# EAGLE design motion_daughter (EAGLE 7.7.0)
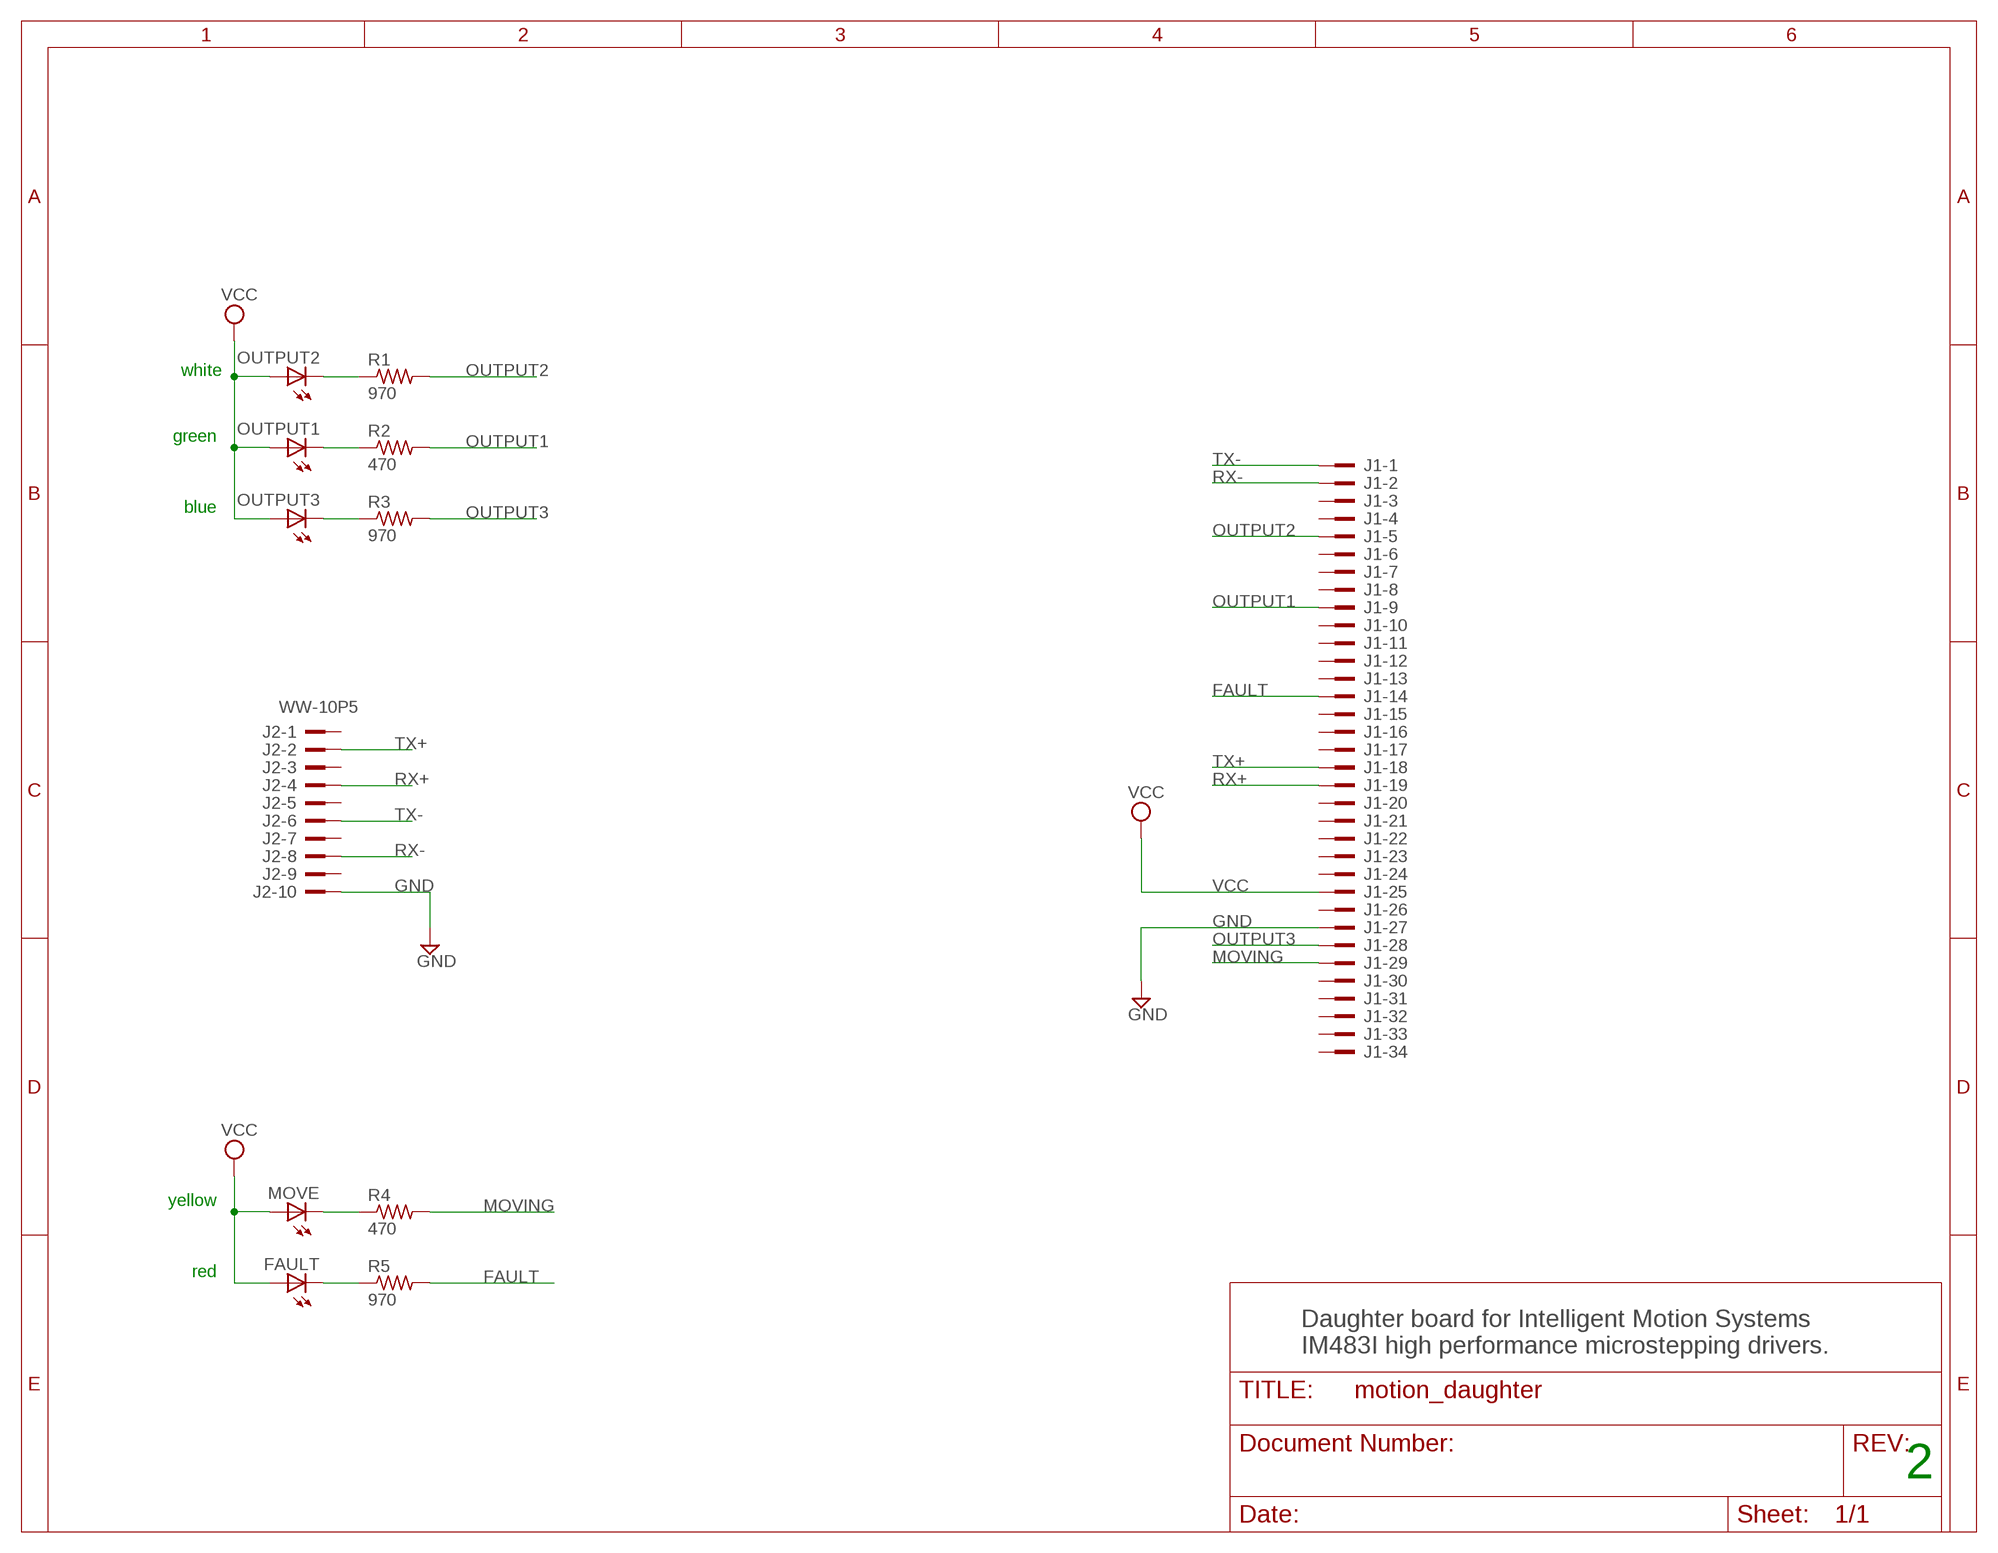
[diagram p0: schematic, sheet 1]

## Parts
FAULT  LED3MM  [LED3MM]
J1  WW-34P-SPECIALIM483I_HEADER  [PAK100/2500-34]
J2  WW-10P5  [PAK100/2500-5-10]
MOVE  LED3MM  [LED3MM]
OUTPUT1  LED3MM  [LED3MM]
OUTPUT2  LED3MM  [LED3MM]
OUTPUT3  LED3MM  [LED3MM]
R1  970  R-US_0207/7  [0207/7]
R2  470  R-US_0207/7  [0207/7]
R3  970  R-US_0207/7  [0207/7]
R4  470  R-US_0207/7  [0207/7]
R5  970  R-US_0207/7  [0207/7]

## Nets
FAULT: J1.P14 R5.2
GND: J1.P27 J2.10
MOVING: J1.P29 R4.2
N$1: OUTPUT3.K(C) R3.1
N$2: OUTPUT1.K(C) R2.1
N$3: OUTPUT2.K(C) R1.1
N$4: MOVE.K(C) R4.1
N$5: FAULT.K(C) R5.1
OUTPUT1: J1.P9 R2.2
OUTPUT2: J1.P5 R1.2
OUTPUT3: J1.P28 R3.2
RX+: J1.P19 J2.4
RX-: J1.P2 J2.8
TX+: J1.P18 J2.2
TX-: J1.P1 J2.6
VCC: FAULT.A J1.P25 MOVE.A OUTPUT1.A OUTPUT2.A OUTPUT3.A
Unconnected: J1.P3 J1.P4 J1.P6 J1.P7 J1.P8 J1.P10 J1.P11 J1.P12 J1.P13 J1.P15 J1.P16 J1.P17 J1.P20 J1.P21 J1.P22 J1.P23 J1.P24 J1.P26 J1.P30 J1.P31 J1.P32 J1.P33 J1.P34 J2.1 J2.3 J2.5 J2.7 J2.9

## Notes on the sheet
- white
- green
- blue
- yellow
- red
- Daughter board for Intelligent Motion Systems 
  IM483I high performance microstepping drivers.
- 2

## Library data of the parts
FAULT MOVE OUTPUT1-OUTPUT3 = led:LED: LED OSRAM: - CHIPLED LG R971, LG N971, LY N971, LG Q971, LY Q971, LO R971, LY R971 LH N974, LH R974 LS Q976, LO Q976, LY Q976 LO Q996 - Hyper CHIPLED LW Q18S LB Q993, LB Q99A, LB R99A - SideLED LS A670, LO A670, LY A670, LG A670, LP A670 LB A673, LV A673, LT A673, LW A673 LH A674 LY A675 LS A676, LA A676, LO A676, LY A676, LW A676 LS A679, LY A679, LG A679 - Hyper Micro SIDELED® LS Y876, LA Y876, LO Y876, LY Y876 LT Y87S - SmartLED LW L88C, LW L88S LB L89C, LB L89S, LG L890 LS L89K, LO L89K, LY L89K LS L896, LA L896, LO L896, LY L896 - TOPLED LS T670, LO T670, LY T670, LG T670, LP T670 LSG T670, LSP T670, LSY T670, LOP T670, LYG T670 LG T671, LOG T671, LSG T671 LB T673, LV T673, LT T673, LW T673 LH T674 LS T676, LA T676, LO T676, LY T676, LB T676, LH T676, LSB T676, LW T676 LB T67C, LV T67C, LT T67C, LS T67K, LO T67K, LY T67K, LW E67C LS E67B, LA E67B, LO E67B, LY E67B, LB E67C, LV E67C, LT E67C LW T67C LS T679, LY T679, LG T679 LS T770, LO T770, LY T770, LG T770, LP T770 LB T773, LV T773, LT T773, LW T773 LH T774 LS E675, LA E675, LY E675, LS T675 LS T776, LA T776, LO T776, LY T776, LB T776 LHGB T686 LT T68C, LB T68C - Hyper Mini TOPLED® LB M676 - Mini TOPLED Santana® LG M470 LS M47K, LO M47K, LY M47K Source: http://www.osram.convergy.de LUXEON: - LUMILED® LXK2-PW12-R00, LXK2-PW12-S00, LXK2-PW14-U00, LXK2-PW14-V00 LXK2-PM12-R00, LXK2-PM12-S00, LXK2-PM14-U00 LXK2-PE12-Q00, LXK2-PE12-R00, LXK2-PE12-S00, LXK2-PE14-T00, LXK2-PE14-U00 LXK2-PB12-K00, LXK2-PB12-L00, LXK2-PB12-M00, LXK2-PB14-N00, LXK2-PB14-P00, LXK2-PB14-Q00 LXK2-PR12-L00, LXK2-PR12-M00, LXK2-PR14-Q00, LXK2-PR14-R00 LXK2-PD12-Q00, LXK2-PD12-R00, LXK2-PD12-S00 LXK2-PH12-R00, LXK2-PH12-S00 LXK2-PL12-P00, LXK2-PL12-Q00, LXK2-PL12-R00 Source: www.luxeon.com KINGBRIGHT: KA-3528ASYC Source: www.kingbright.com
J1 = worlickwerx:WW-34P-SPECIAL: 34 pin header, special pin numbers; OC_FARNELL: unknown; OC_NEWARK: unknown
J2 = worlickwerx:WW-10P: 3M (TM) Pak 100 4-Wall Header Source: 3M; OC_FARNELL: 1788669; OC_NEWARK: unknown
R1-R5 = resistor:R-US_: RESISTOR, American symbol

## Board
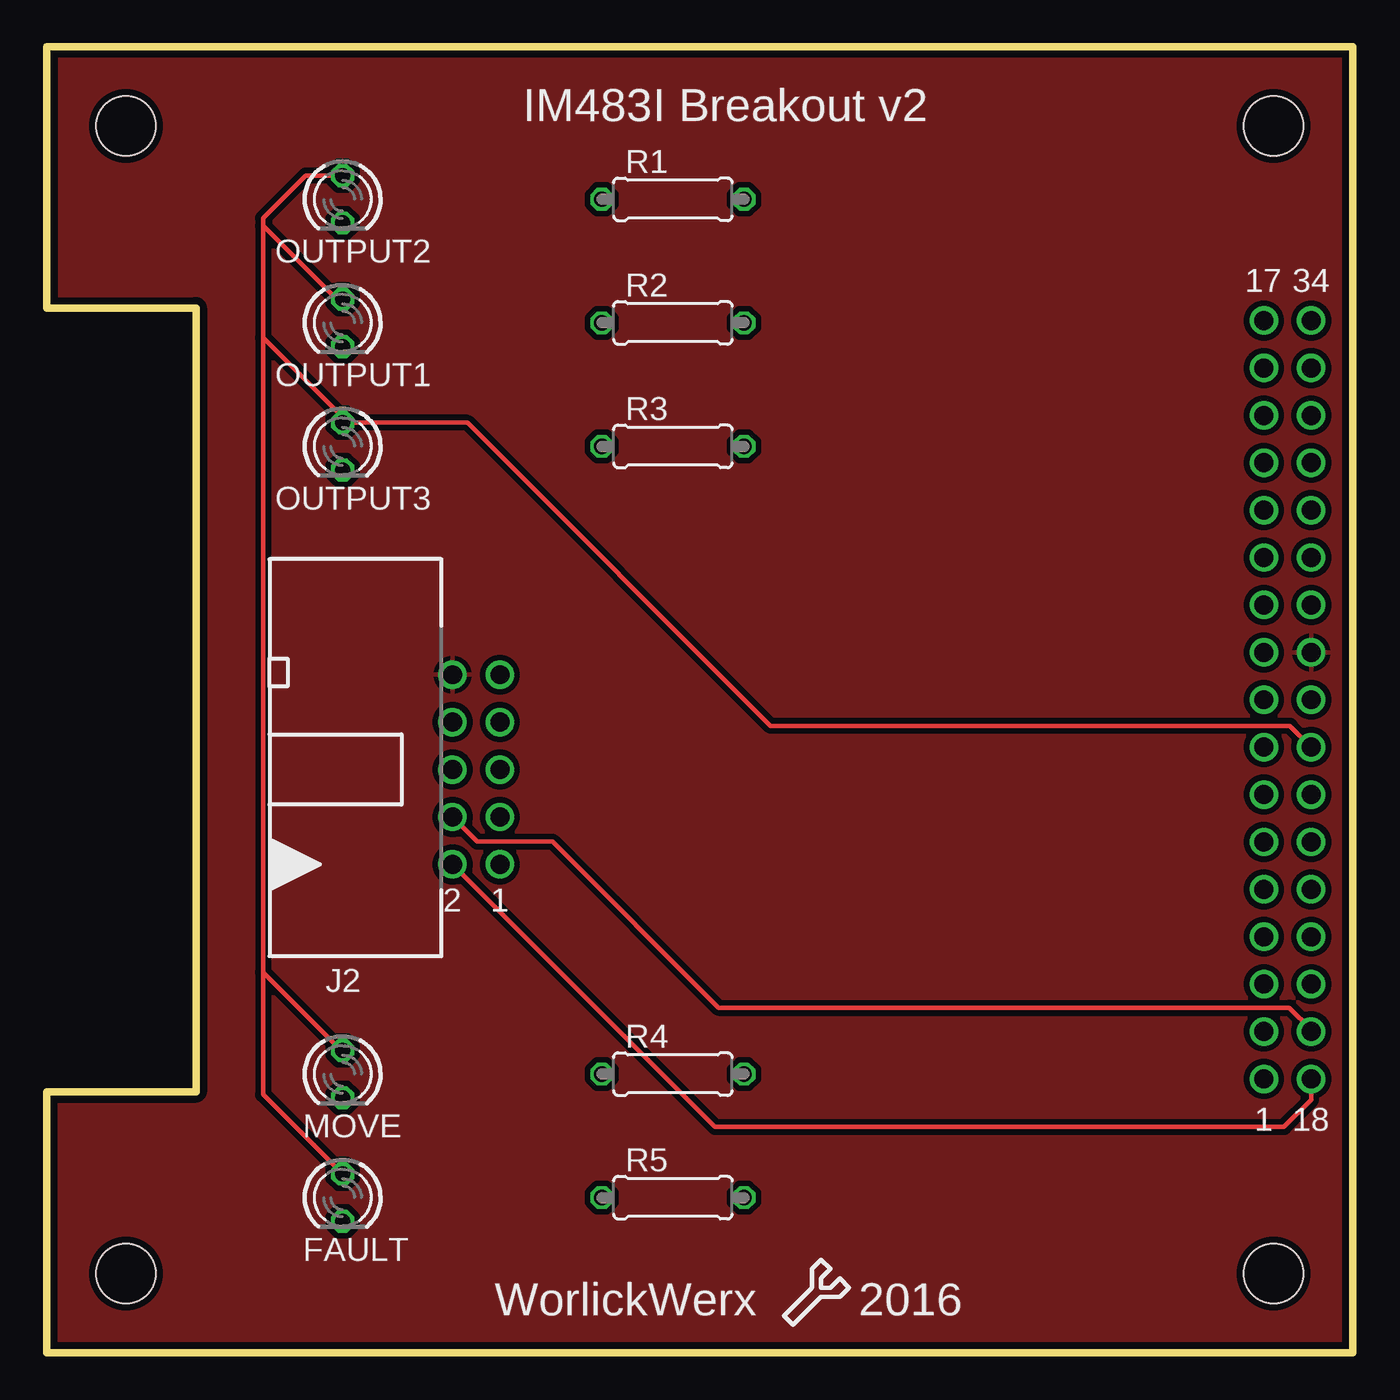
[diagram p1: board, top side]
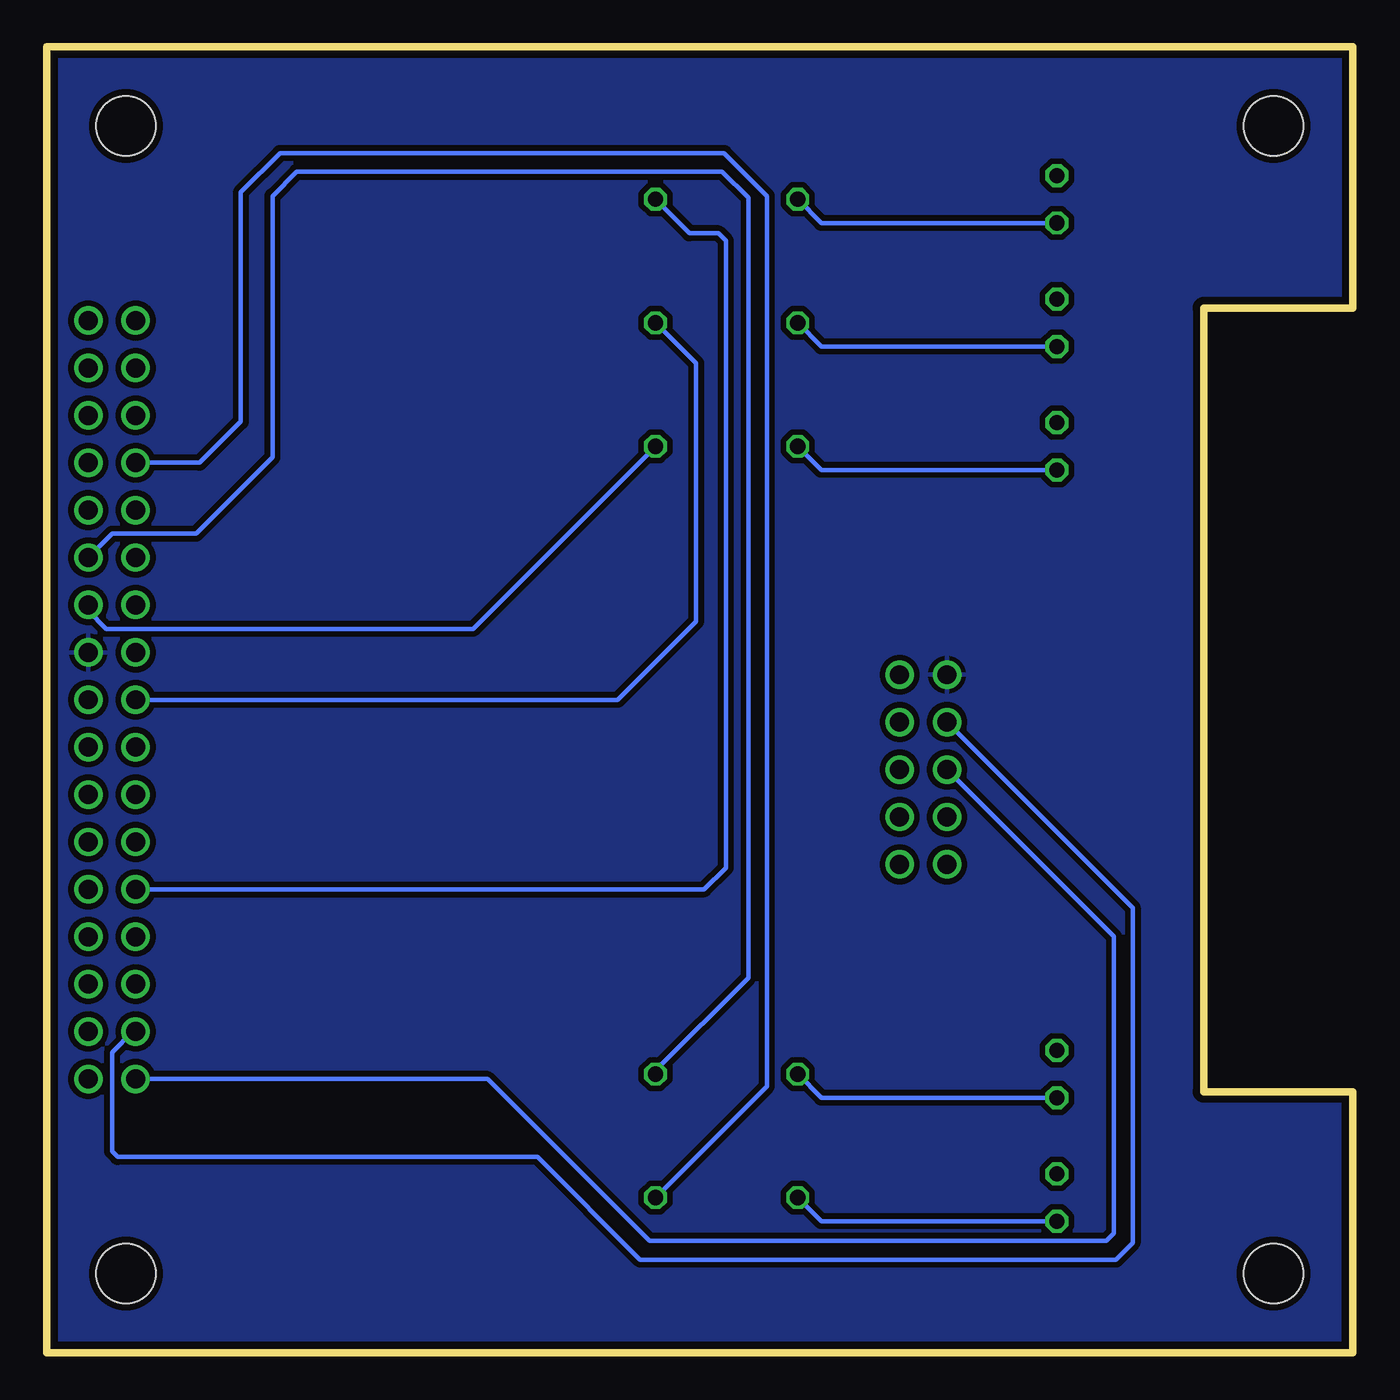
[diagram p2: board, bottom side, seen from below]

Size 70 x 70 mm. Coordinates in mm from the lower left corner, seen from the top.
Outline: 0,0 70,0 70,70 0,70 0,56 8,56 8,14 0,14 0,0
Copper layers (1*16): Top 0.0356mm / dielectric 1.5011mm / Bottom 0.0356mm
Design rules "oshpark-2layer": minimum track width 6mil, minimum drill 13mil, track to track 6mil, track to pad 6mil, pad to pad 6mil, via to via 6mil, smd to smd 6mil, copper to edge 15mil, drill to drill 6mil, minimum pad ring 7mil, minimum via ring 7mil, stop-mask expansion 2.5mil, vias tented up to drill 0mil, thermal gap 10mil
Holes 3.17 mm at 4.25,65.75 4.25,4.25 65.75,4.25 65.75,65.75
Milling: 8 lines

### Footprints (pad centres in the part's own frame; a part is rotated, then mirrored left to right if it is on the bottom)
LED3MM = drill 0.813 octagon: A -1.27,0; K 1.27,0
PAK100/2500-34 = drill 1.016 pad 1.422: P1 -20.32,1.27; P2 -17.78,1.27; P3 -15.24,1.27; P4 -12.7,1.27; P5 -10.16,1.27; P6 -7.62,1.27; P7 -5.08,1.27; P8 -2.54,1.27; P9 0,1.27; P10 2.54,1.27; P11 5.08,1.27; P12 7.62,1.27; P13 10.16,1.27; P14 12.7,1.27; P15 15.24,1.27; P16 17.78,1.27; P17 20.32,1.27; P18 -20.32,-1.27; P19 -17.78,-1.27; P20 -15.24,-1.27; P21 -12.7,-1.27; P22 -10.16,-1.27; P23 -7.62,-1.27; P24 -5.08,-1.27; P25 -2.54,-1.27; P26 0,-1.27; P27 2.54,-1.27; P28 5.08,-1.27; P29 7.62,-1.27; P30 10.16,-1.27; P31 12.7,-1.27; P32 15.24,-1.27; P33 17.78,-1.27; P34 20.32,-1.27
PAK100/2500-5-10 = drill 1.016 pad 1.422: 1 -5.08,-1.27; 2 -5.08,1.27; 3 -2.54,-1.27; 4 -2.54,1.27; 5 0,-1.27; 6 0,1.27; 7 2.54,-1.27; 8 2.54,1.27; 9 5.08,-1.27; 10 5.08,1.27
0207/7 = drill 0.813 octagon: 1 -3.81,0; 2 3.81,0

### Placement (x,y rotation side)
FAULT  15.86,8.32 270 top
J1  66.5,35 90 top
J2  23.02,31.26 90 top
MOVE  15.86,14.94 270 top
OUTPUT1  15.86,55.2 270 top
OUTPUT2  15.86,61.82 270 top
OUTPUT3  15.86,48.58 270 top
R1  33.56,61.82 0 top
R2  33.56,55.2 0 top
R3  33.56,48.58 0 top
R4  33.56,14.94 0 top
R5  33.56,8.32 0 top

### Tracks (layer width: path | path; a pad name or v marks a point on that pad's centre or on a via)
FAULT
  Bottom 0.254: R5.2 31.4,14.29 31.4,62 33.7,64.3 57.5,64.3 59.6,62.2 59.6,49.9 61.8,47.7 J1.P14
GND
  pour Bottom (isolate 0.305): 0,70 0,56 8,56 8,14 0,14 0,0 70,0 70,70
  pour Top (isolate 0.305): 0,70 0,56 8,56 8,14 0,14 0,0 70,0 70,70
MOVING
  Bottom 0.254: J1.P29 66.49,43.9 62,43.9 57.9,48 57.9,62 56.6,63.3 33.8,63.3 32.4,61.9 32.4,20.1 37.37,15.13 R4.2
N$1
  Bottom 0.254: OUTPUT3.K 28.48,47.31 R3.1
N$2
  Bottom 0.254: OUTPUT1.K 28.48,53.93 R2.1
N$3
  Bottom 0.254: OUTPUT2.K 28.48,60.55 R1.1
N$4
  Bottom 0.254: MOVE.K 28.48,13.67 R4.1
N$5
  Bottom 0.254: FAULT.K 28.48,7.05 R5.1
OUTPUT1
  Bottom 0.254: R2.2 35.2,53.03 35.2,39.2 39.4,35 J1.P9
OUTPUT2
  Bottom 0.254: J1.P5 34.76,24.84 33.6,26 33.6,59.6 34,60 35.55,60 R1.2
OUTPUT3
  Bottom 0.254: R3.2 47.15,38.8 66.8,38.8 67.77,39.77 J1.P28
RX+
  Top 0.254: J2.4 23.07,27.4 27.1,27.4 36,18.5 66.6,18.5 67.77,17.33 J1.P19
RX-
  Bottom 0.254: J2.8 11.8,23.85 11.8,5.9 12.7,5 38.2,5 43.7,10.5 66.2,10.5 66.5,10.8 66.5,16.1 65.38,17.22 J1.P2
TX+
  Top 0.254: J2.2 35.83,12.1 66.3,12.1 67.77,13.57 J1.P18
TX-
  Bottom 0.254: J2.6 12.8,22.31 12.8,6.4 13.2,6 37.7,6 46.38,14.68 J1.P1
VCC
  Top 0.254: OUTPUT2.A 13.89,63.09 11.6,60.8 11.6,60.4 | 11.6,60.4 11.6,54.4 | 11.6,54.4 11.6,20.4 | 11.6,20.4 11.6,13.85 FAULT.A | MOVE.A 15.79,16.21 11.6,20.4 | 11.6,54.4 15.86,50.14 OUTPUT3.A 22.55,49.85 38.8,33.6 66.63,33.6 J1.P25 | OUTPUT1.A 15.53,56.47 11.6,60.4

### Text on the board
tPlace: IM483I Breakout v2 | WorlickWerx | 2016